# Altium schematic sheet Power_supply.SchDoc
size A4; SheetNumber: 1; SheetTotal: 5
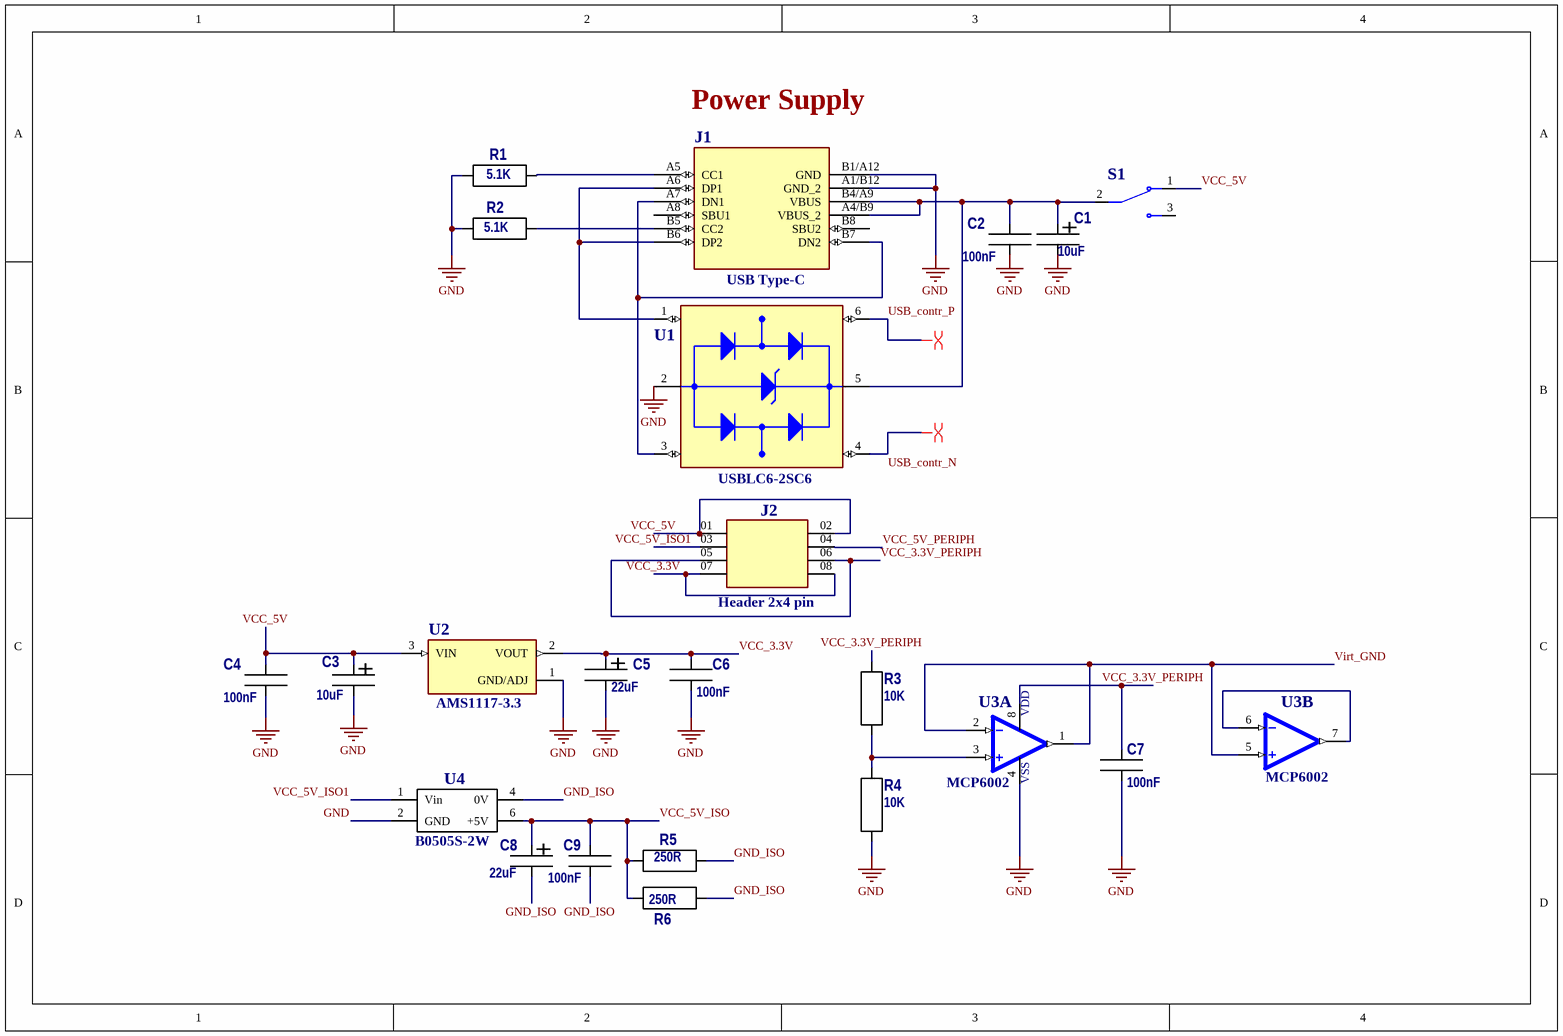
[diagram p0: Power_supply.SchDoc]

## Parts
C1  10uF  [Tant B]
C2  100nF  [Cap 0805 3D]
C3  10uF  [Tant B]
C4  100nF  [Cap 0805 3D]
C5  22uF  [Tant B]
C6  100nF  [Cap 0805 3D]
C7  100nF  [Cap 0805 3D]
C8  22uF  [Tant B]
C9  100nF  [Cap 0805 3D]
J1  USB Type-C  [216990-0002_MOL]
J2  Header 2x4 pin  [SAMTEC_TSW-104-08-T-D]
R1  5.1K  [Res_0805 3D]
R2  5.1K  [Res_0805 3D]
R3  10K  [Res_1206 3D]
R4  10K  [Res_1206 3D]
R5  250R  [Res_1206 3D]
R6  250R  [Res_1206 3D]
S1  STS121RA04  [TE_STS121RA04]  (value not drawn)
U1  USBLC6-2SC6  [SOT95P280X145-6N]
U2  AMS1117-3.3  [SOT229P700X180-4N]
U3  MCP6002  [SOIC127P600X175-8N]  (parts A,B of 2)
U4  B0505S-2W  [B0505S-2W]

## Nets
GND: C1.2(-) C2.2 C3.2(-) C4.2 C5.2(-) C6.2 C7.2 J1.A1/B12(GND_2) J1.B1/A12(GND) R1.2 R2.2 R4.1 U1.2(GND) U2.1(GND/ADJ) U3.4(VSS) U4.2(GND)
GND_ISO: C8.2(-) C9.2 R5.1 R6.1 U4.4(0V)
USB_contr_N: U1.4(I/O2_OUT)
USB_contr_P: U1.6(I/O1_OUT)
VCC_3.3V: C5.1(+) C6.1 J2.07 J2.08 U2.2(VOUT)
VCC_3.3V_PERIPH: C7.1 J2.05 J2.06 R3.2 U3.8(VDD)
VCC_5V: C3.1(+) C4.1 J2.01 J2.02 S1.1 U2.3(VIN)
VCC_5V_ISO: C8.1(+) C9.1 R5.2 R6.2 U4.6(+5V)
VCC_5V_ISO1: J2.03 U4.1(Vin)
VCC_5V_PERIPH: J2.04
Virt_GND: U3.1(VOUTA) U3.2(VINA-) U3.5(VINB+)
NetC1_1: C1.1(+) C2.1 J1.A4/B9(VBUS_2) J1.B4/A9(VBUS) S1.2 U1.5(VBUS)
NetJ1_A5: J1.A5(CC1) R1.1
NetJ1_A6: J1.A6(DP1) J1.B6(DP2) U1.1(I/O1_IN)
NetJ1_A7: J1.A7(DN1) J1.B7(DN2) U1.3(I/O2_IN)
NetJ1_B5: J1.B5(CC2) R2.1
NetR3_1: R3.1 R4.2 U3.3(VINA+)
NetU3_6: U3.6(VINB-) U3.7(VOUTB)

Not connected (* = marked no-connect by the designer): J1 A8(SBU1) B8(SBU2); S1 3

## Layout directives
differential pair: USB_contr_N, USB_contr_P

## Notes on the sheet
- Power Supply

## Library data of the parts
C1 C3 = C T: SMD type B 10 uF min 16V
C2 C4 C6 C7 C9 = C: SMD 0805 100nF
C5 C8 = C T: SMD type B 22 uF min 16V
J1 = 2169900002: MF: {'manufacturer': u'Molex'}; Package: None; Price: None; Value: *; MP: 2169900002; Availability: Unavailable
J2 = TSW-104-08-T-D: Package: None; Price: None; Value: *; MP: TSW-104-08-T-D; Availability: Unavailable
R1 R2 = R: 0603 0.1%
R3-R6 = R: 0805 10K
S1 = STS121RA04: Slide Switch SPDT Through Hole, Right Angle; MF: TE Connectivity; SnapEDA_Link: https://www.snapeda.com/parts/STS121RA04/TE+Connectivity+ALCOSWITCH+Switches/view-part/?ref=snap; Package: None; Value: *; MP: STS121RA04; Check_prices: https://www.snapeda.com/parts/STS121RA04/TE+Connectivity+ALCOSWITCH+Switches/view-part/?ref=eda
U1 = USBLC6-2SC6: 17V Clamp 5A (8/20Âµs) Ipp Tvs Diode Surface Mount SOT-23-6; MF: STMicroelectronics; Value: *; SnapEDA_Link: https://www.snapeda.com/parts/USBLC6-2SC6/STMicroelectronics/view-part/?ref=snap; Check_prices: https://www.snapeda.com/parts/USBLC6-2SC6/STMicroelectronics/view-part/?ref=eda; Purchase-URL: https://pricing.snapeda.com/search/part/USBLC6-2SC6/?ref=eda; Price: None; Availability: In Stock; Package: SOT-23-6 STMicroelectronics; MP: USBLC6-2SC6
U2 = AMS1117-5.0: 1A LOW DROPOUT VOLTAGE REGULATOR; MF: ams; MP: AMS1117-5.0; Package: SOT-223 Seeed Technology; SnapEDA_Link: https://www.snapeda.com/parts/AMS1117-5.0/ams/view-part/?ref=snap; Check_prices: https://www.snapeda.com/parts/AMS1117-5.0/ams/view-part/?ref=eda; Availability: Not in stock; Value: *; Price: None
U3 = MCP6002-I/SN: Microchip , Dual Op Amp, 1MHzCMOS, Rail to Rail, 3V, 5V, 8-Pin SOIC | Microchip Technology Inc. MCP6002-I/SN; SnapEDA_Link: https://www.snapeda.com/parts/MCP6002-I/SN/Microchip/view-part/?ref=snap; Package: SO-8 Microchip; Value: *; MF: Microchip; MP: MCP6002-I/SN; Check_prices: https://www.snapeda.com/parts/MCP6002-I/SN/Microchip/view-part/?ref=eda
U4 = B0505S-2W: Изолированный DC-DC преобразователь, вход 5В, выход 5В 3Вт